# Altium project IND_ENC_v1r0.PrjPCB
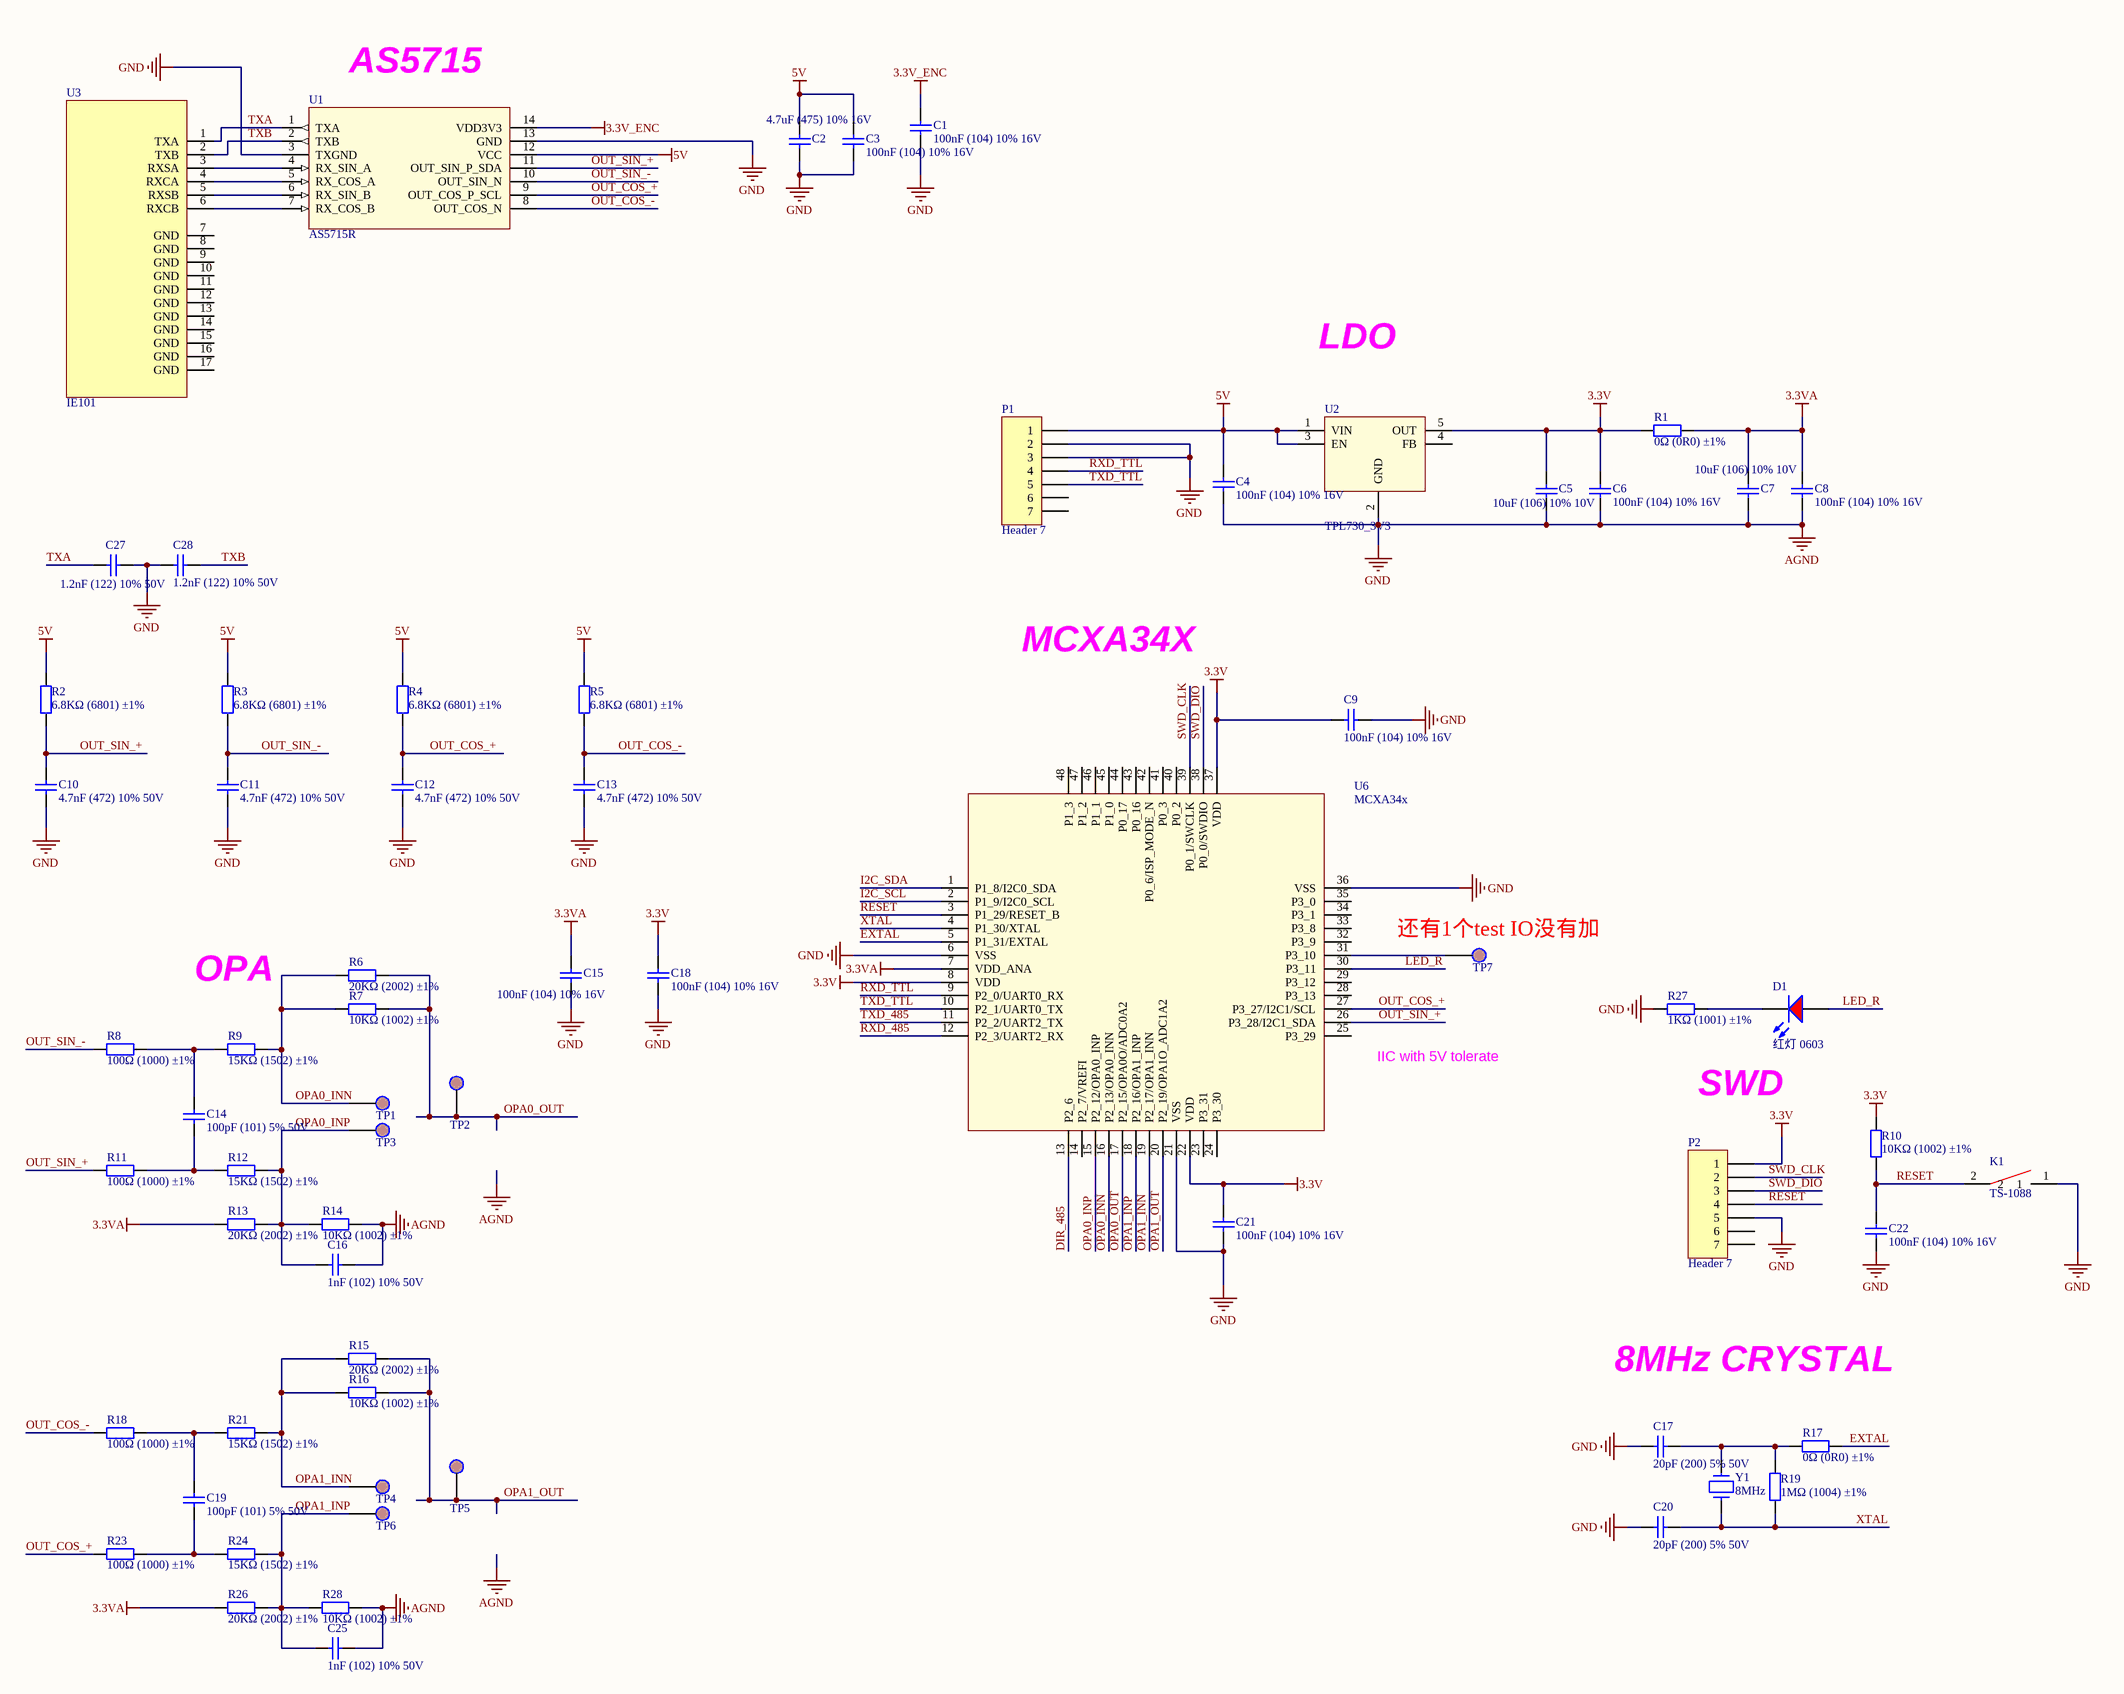
[diagram p0: IND_EC.SchDoc]
1 sheet, 66 parts. Net scope: global (net labels, ports and power ports of the same name join across sheets).
Board file: IND_ENC_v1r0.PcbDoc

## Sheet IND_EC.SchDoc
size A2

### Parts
C1  100nF (104) 10% 16V  [0402_C]
C2  4.7uF (475) 10% 16V  [0603_C]
C3  100nF (104) 10% 16V  [0402_C]
C4  100nF (104) 10% 16V  [0402_C]
C5  10uF (106) 10% 10V  [0603_C]
C6  100nF (104) 10% 16V  [0402_C]
C7  10uF (106) 10% 10V  [0603_C]
C8  100nF (104) 10% 16V  [0402_C]
C9  100nF (104) 10% 16V  [0402_C]
C10  4.7nF (472) 10% 50V  [0402_C]
C11  4.7nF (472) 10% 50V  [0402_C]
C12  4.7nF (472) 10% 50V  [0402_C]
C13  4.7nF (472) 10% 50V  [0402_C]
C14  100pF (101) 5% 50V  [0402_C]
C15  100nF (104) 10% 16V  [0402_C]
C16  1nF (102) 10% 50V  [0402_C]
C17  20pF (200) 5% 50V  [0603_C]
C18  100nF (104) 10% 16V  [0402_C]
C19  100pF (101) 5% 50V  [0402_C]
C20  20pF (200) 5% 50V  [0603_C]
C21  100nF (104) 10% 16V  [0402_C]
C22  100nF (104) 10% 16V  [0402_C]
C25  1nF (102) 10% 50V  [0402_C]
C27  1.2nF (122) 10% 50V  [0603_C]
C28  1.2nF (122) 10% 50V  [0603_C]
D1  红灯 0603  [0603_LED_S1]
K1  TS-1088  [SW-SMD_L3.9-W3.0-P4.45]
P1  Header 7  [CONN-MX1.25-5P_SMD_L]
P2  Header 7  [CONN-MX1.25-5P_SMD_L]
R1  0Ω (0R0) ±1%  [0603_R]
R2  6.8KΩ (6801) ±1%  [0402_R]
R3  6.8KΩ (6801) ±1%  [0402_R]
R4  6.8KΩ (6801) ±1%  [0402_R]
R5  6.8KΩ (6801) ±1%  [0402_R]
R6  20KΩ (2002) ±1%  [0402_R]
R7  10KΩ (1002) ±1%  [0402_R]
R8  100Ω (1000) ±1%  [0402_R]
R9  15KΩ (1502) ±1%  [0402_R]
R10  10KΩ (1002) ±1%  [0402_R]
R11  100Ω (1000) ±1%  [0402_R]
R12  15KΩ (1502) ±1%  [0402_R]
R13  20KΩ (2002) ±1%  [0402_R]
R14  10KΩ (1002) ±1%  [0402_R]
R15  20KΩ (2002) ±1%  [0402_R]
R16  10KΩ (1002) ±1%  [0402_R]
R17  0Ω (0R0) ±1%  [0603_R]
R18  100Ω (1000) ±1%  [0402_R]
R19  1MΩ (1004) ±1%  [0603_R]
R21  15KΩ (1502) ±1%  [0402_R]
R23  100Ω (1000) ±1%  [0402_R]
R24  15KΩ (1502) ±1%  [0402_R]
R26  20KΩ (2002) ±1%  [0402_R]
R27  1KΩ (1001) ±1%  [0603_R]
R28  10KΩ (1002) ±1%  [0402_R]
TP1  TP?  [TPP]  (value not drawn)
TP2  TP?  [TPP]  (value not drawn)
TP3  TP?  [TPP]  (value not drawn)
TP4  TP?  [TPP]  (value not drawn)
TP5  TP?  [TPP]  (value not drawn)
TP6  TP?  [TPP]  (value not drawn)
TP7  TP?  [TPP]  (value not drawn)
U1  AS5715R  [TSSOP-14]
U2  TPL730_3V3  [SOT-23-5]
U3  IE101  [ie101]
U6  MCXA34x  [LQFP48]
Y1  8MHz  [SMD_5032_2P]

### Nets
3.3V: C5.2 C6.2 C9.2 C18.2 C21.2 P2.1 R1.1 R10.2 U2.5(OUT) U6.8(VDD) U6.22(VDD) U6.37(VDD)
3.3V_ENC: C1.2 U1.14(VDD3V3)
3.3VA: C7.2 C8.2 C15.2 R1.2 R13.1 R26.1 U6.7(VDD_ANA)
5V: C2.2 C3.2 C4.2 P1.1 R2.2 R3.2 R4.2 R5.2 U1.12(VCC) U2.1(VIN) U2.3(EN)
AGND: C1.1 C2.1 C3.1 C4.1 C5.1 C6.1 C7.1 C8.1 C9.1 C10.1 C11.1 C12.1 C13.1 C15.1 C16.2 C17.2 C18.1 C20.2 C21.1 C22.1 C25.2 C27.2 C28.1 K1.1 P1.2 P1.3 P2.5 R14.2 R27.1 R28.2 U1.3(TXGND) U1.13(GND) U2.2(GND) U6.6(VSS) U6.21(VSS) U6.36(VSS)  [also labelled GND]
DIR_485: U6.13(P2_6)
EXTAL: R17.1 U6.5(P1_31/EXTAL)
I2C_SCL: U6.2(P1_9/I2C0_SCL)
I2C_SDA: U6.1(P1_8/I2C0_SDA)
LED_R: D1.A U6.30(P3_11)
OPA0_INN: R6.1 R7.1 R9.2 TP1.1 U6.16(P2_13/OPA0_INN)
OPA0_INP: C16.1 R12.2 R13.2 R14.1 TP3.1 U6.15(P2_12/OPA0_INP)
OPA0_OUT: R6.2 R7.2 TP2.1 U6.17(P2_15/OPA0O/ADC0A2)
OPA1_INN: R15.1 R16.1 R21.2 TP4.1 U6.19(P2_17/OPA1_INN)
OPA1_INP: C25.1 R24.2 R26.2 R28.1 TP6.1 U6.18(P2_16/OPA1_INP)
OPA1_OUT: R15.2 R16.2 TP5.1 U6.20(P2_19/OPA1O_ADC1A2)
OUT_COS_+: C12.2 R4.1 R23.1 U1.9(OUT_COS_P_SCL) U6.27(P3_27/I2C1/SCL)
OUT_COS_-: C13.2 R5.1 R18.1 U1.8(OUT_COS_N)
OUT_SIN_+: C10.2 R2.1 R11.1 U1.11(OUT_SIN_P_SDA) U6.26(P3_28/I2C1_SDA)
OUT_SIN_-: C11.2 R3.1 R8.1 U1.10(OUT_SIN_N)
RESET: C22.2 K1.2 P2.4 R10.1 U6.3(P1_29/RESET_B)
RXD_485: U6.12(P2_3/UART2_RX)
RXD_TTL: P1.4 U6.9(P2_0/UART0_RX)
SWD_CLK: P2.2 U6.39(P0_1/SWCLK)
SWD_DIO: P2.3 U6.38(P0_0/SWDIO)
TXA: C27.1 U1.1(TXA) U3.1(TXA)
TXB: C28.2 U1.2(TXB) U3.2(TXB)
TXD_485: U6.11(P2_2/UART2_TX)
TXD_TTL: P1.5 U6.10(P2_1/UART0_TX)
XTAL: C20.1 R19.1 U6.4(P1_30/XTAL) Y1.1
NetC14_1: C14.1 R11.2 R12.1
NetC14_2: C14.2 R8.2 R9.1
NetC17_1: C17.1 R17.2 R19.2 Y1.2
NetC19_1: C19.1 R23.2 R24.1
NetC19_2: C19.2 R18.2 R21.1
NetD1_K: D1.K R27.2
NetTP7_1: TP7.1 U6.31(P3_10)
NetU1_4: U1.4(RX_SIN_A) U3.3(RXSA)
NetU1_5: U1.5(RX_COS_A) U3.4(RXCA)
NetU1_6: U1.6(RX_SIN_B) U3.5(RXSB)
NetU1_7: U1.7(RX_COS_B) U3.6(RXCB)

Not connected (* = marked no-connect by the designer): P1 6 7; P2 6 7; U2 4(FB); U3 7(GND) 8(GND) 9(GND) 10(GND) 11(GND) 12(GND) 13(GND) 14(GND) 15(GND) 16(GND) 17(GND); U6 14(P2_7/VREFI) 23(P3_31) 24(P3_30) 25(P3_29) 28(P3_13) 29(P3_12) 32(P3_9) 33(P3_8) 34(P3_1) 35(P3_0) 40(P0_2) 41(P0_3) 42(P0_6/ISP_MODE_N) 43(P0_16) 44(P0_17) 45(P1_0) 46(P1_1) 47(P1_2) 48(P1_3)

### Notes on the sheet
- (near U1) AS5715
- LDO
- MCXA34X
- OPA
- (near TP7) 还有1个test IO没有加
- (near U6) IIC with 5V tolerate
- SWD
- 8MHz CRYSTAL

### Library data of the parts
C1 C3 C4 C6 C8 C9 C15 C18 C21 C22 = 0402 100nF (104) 10% 16V: 贴片电容; ComponentLink1Description: 供应商链接; ComponentLink1URL: http://www.szlcsc.com/product/details_1877.html; Package: 0402; Supplier: LC; SuppliersPartNumber: C1525
C2 = 0603 4.7uF (475) 10% 16V: 贴片电容; ComponentLink1Description: 供应商链接; ComponentLink1URL: http://www.szlcsc.com/product/details_20375.html; Package: 0603; Supplier: LC; SuppliersPartNumber: C19666
C5 C7 = 0603 10uF (106) 10% 10V: 贴片电容; ComponentLink1Description: 供应商链接; ComponentLink1URL: http://www.szlcsc.com/product/details_20411.html; Package: 0603; Supplier: LC; SuppliersPartNumber: C19702
C10-C13 = 0402 4.7nF (472) 10% 50V: 贴片电容; ComponentLink1Description: 供应商链接; ComponentLink1URL: http://www.szlcsc.com/product/details_1890.html; Package: 0402; Supplier: LC; SuppliersPartNumber: C1538
C14 C19 = 0402 100pF (101) 5% 50V: 贴片电容; ComponentLink1Description: 供应商链接; ComponentLink1URL: http://www.szlcsc.com/product/details_1898.html; Package: 0402; Supplier: LC; SuppliersPartNumber: C1546
C16 C25 = 0402 1nF (102) 10% 50V: 贴片电容; ComponentLink1Description: 供应商链接; ComponentLink1URL: http://www.szlcsc.com/product/details_1875.html; Package: 0402; Supplier: LC; SuppliersPartNumber: C1523
C17 C20 = 0603 20pF (200) 5% 50V: 贴片电容; ComponentLink1Description: 供应商链接; ComponentLink1URL: http://www.szlcsc.com/product/details_2000.html; Package: 0603; Supplier: LC; SuppliersPartNumber: C1648
C27 C28 = 0603 1.2nF (122) 10% 50V: 贴片电容; ComponentLink1Description: 供应商链接; ComponentLink1URL: http://www.szlcsc.com/product/details_31372.html; Package: 0603; Supplier: LC; SuppliersPartNumber: C30615
D1 = 0603 红灯: 发光二极管; ComponentLink1Description: 供应商链接; ComponentLink1URL: http://www.szlcsc.com/product/details_2659.html; Package: 0603; Supplier: LC; SuppliersPartNumber: C2286
K1 = Key_2P: 贴片2脚按键
P1 P2 = Header 7: Header, 7-Pin; LatestRevisionDate: 17-Jul-2002; LatestRevisionNote: Re-released for DXP Platform.; Publisher: Altium Limited
R1 R17 = 0603 0Ω (0R0) 1%: 贴片电阻; ComponentLink1Description: 供应商链接; ComponentLink1URL: http://www.szlcsc.com/product/details_21903.html; Package: 0603; Supplier: LC; SuppliersPartNumber: C21189
R2-R5 = 0402 6.8KΩ (6801) 1%: 贴片电阻; ComponentLink1Description: 供应商链接; ComponentLink1URL: http://www.szlcsc.com/product/details_26660.html; Package: 0402; Supplier: LC; SuppliersPartNumber: C25917
R6 R13 R15 R26 = 0402 20KΩ (2002) 1%: 贴片电阻; ComponentLink1Description: 供应商链接; ComponentLink1URL: http://www.szlcsc.com/product/details_26508.html; Package: 0402; Supplier: LC; SuppliersPartNumber: C25765
R7 R10 R14 R16 R28 = 0402 10KΩ (1002) 1%: 贴片电阻; ComponentLink1Description: 供应商链接; ComponentLink1URL: http://www.szlcsc.com/product/details_26487.html; Package: 0402; Supplier: LC; SuppliersPartNumber: C25744
R8 R11 R18 R23 = 0402 100Ω (1000) 1%: 贴片电阻; ComponentLink1Description: 供应商链接; ComponentLink1URL: http://www.szlcsc.com/product/details_25819.html; Package: 0402; Supplier: LC; SuppliersPartNumber: C25076
R9 R12 R21 R24 = 0402 15KΩ (1502) 1%: 贴片电阻; ComponentLink1Description: 供应商链接; ComponentLink1URL: http://www.szlcsc.com/product/details_26499.html; Package: 0402; Supplier: LC; SuppliersPartNumber: C25756
R19 = 0603 1MΩ (1004) 1%: 贴片电阻; ComponentLink1Description: 供应商链接; ComponentLink1URL: http://www.szlcsc.com/product/details_23662.html; Package: 0603; Supplier: LC; SuppliersPartNumber: C22935
R27 = 0603 1KΩ (1001) 1%: 贴片电阻; ComponentLink1Description: 供应商链接; ComponentLink1URL: http://www.szlcsc.com/product/details_21904.html; Package: 0603; Supplier: LC; SuppliersPartNumber: C21190
TP1-TP7 = Test Point
U1 = AS5715R: AMS
U2 = TPL730
U3 = IE101: INC_ENC_CIRCUIT
U6 = MCXA34xVLF: LQFP48
Y1 = Crystal: 晶振